# EAGLE design max522 (EAGLE 7.2.0)
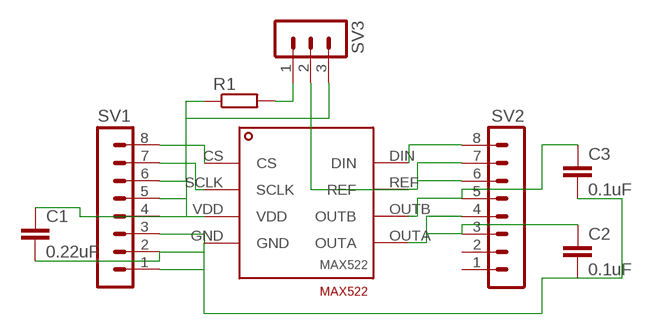
[diagram p0: schematic, sheet 1]

## Parts
C1  0.22uF  C-EUC0805  [C0805]
C2  0.1uF  C-EUC0805  [C0805]
C3  0.1uF  C-EUC0805  [C0805]
R1  R-EU_M0805  [M0805]
SV1  MA08-1  [MA08-1]
SV2  MA08-1  [MA08-1]
SV3  MA03-1  [MA03-1]
U$1  MAX522  [MAX522]

## Nets
N$1: SV1.8 U$1.CS
N$2: SV1.7 U$1.SCLK
N$3: C1.1 R1.1 SV1.4 SV1.5 SV1.6 SV3.3 U$1.VDD
N$4: C1.2 C2.2 C3.2 SV1.1 SV1.2 SV1.3 U$1.GND
N$5: SV2.8 U$1.DIN
N$6: SV2.6 SV2.7 SV3.2 U$1.REF
N$7: C3.1 SV2.5 U$1.OUTB
N$8: C2.1 SV2.3 SV2.4 U$1.OUTA
N$9: R1.2 SV3.1
Unconnected: SV2.1 SV2.2

## Library data of the parts
C1-C3 = rcl:C-EU: CAPACITOR, European symbol
R1 = resistor:R-EU_: RESISTOR, European symbol
SV1 SV2 = con-lstb:MA08-1: PIN HEADER; OC_FARNELL: unknown; OC_NEWARK: unknown
SV3 = con-lstb:MA03-1: PIN HEADER; OC_FARNELL: unknown; OC_NEWARK: unknown
U$1 = MAX522:MAX522

## Board
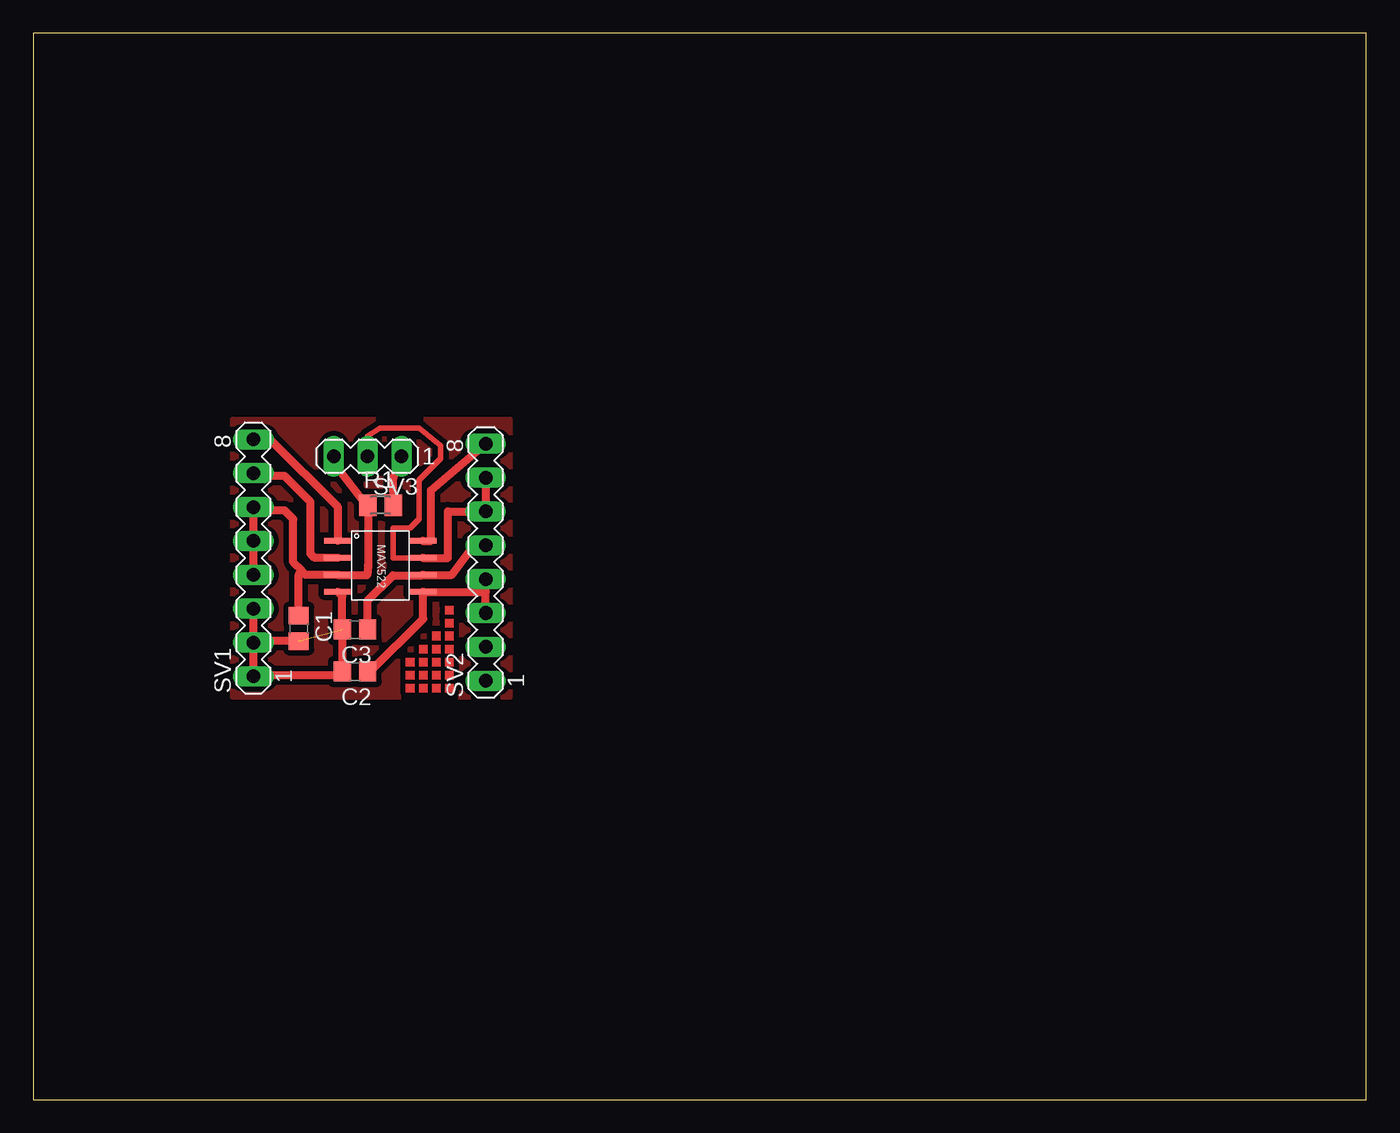
[diagram p1: board, top side]

Size 100 x 80 mm. Coordinates in mm from the lower left corner, seen from the top.
Outline: 0,0 100,0 100,80 0,80 0,0
Copper layers (1*16): Top 0.035mm / dielectric 1.5mm / Bottom 0.035mm
Design rules "default": minimum track width 10mil, minimum drill 24mil, track to track 8mil, track to pad 8mil, pad to pad 8mil, via to via 8mil, smd to smd 8mil, copper to edge 40mil, drill to drill 8mil, minimum pad ring 10mil, minimum via ring 8mil, stop-mask expansion 4mil, vias tented up to drill 0mil, thermal gap 10mil

### Footprints (pad centres in the part's own frame; a part is rotated, then mirrored left to right if it is on the bottom)
C0805 = smd 1.3 x 1.5: 1 -0.95,0; 2 0.95,0
M0805 = smd 1.3 x 1.6: 1 -0.95,0; 2 0.95,0
MA08-1 = drill 1.016 long: 1 -8.89,0; 2 -6.35,0; 3 -3.81,0; 4 -1.27,0; 5 1.27,0; 6 3.81,0; 7 6.35,0; 8 8.89,0
MA03-1 = drill 1.016 long: 1 -2.54,0; 2 0,0; 3 2.54,0
MAX522 = smd 2.1 x 0.406: CS -2.54,1.27; DIN 3.81,1.27; GND -2.54,-2.54; OUTA 3.81,-2.54; OUTB 3.81,-1.27; REF 3.81,0; SCLK -2.54,0; VDD -2.54,-1.27

### Placement (x,y rotation side)
C1  19.91,35.35 270 top
C2  24.13,32.1 180 top
C3  24.13,35.27 180 top
R1  26.05,44.59 0 top
SV1  16.51,40.64 90 top
SV2  33.94,40.31 90 top
SV3  25.07,48.26 180 top
U$1  25.4,40.64 0 top

### Tracks (layer width: path | path; a pad name or v marks a point on that pad's centre or on a via)
N$1
  Top 0.61: U$1.CS 22.86,44.45 17.78,49.53 SV1.8
N$2
  Top 0.61: U$1.SCLK 21.11,40.64 20.8,40.95 20.8,44.85 18.85,46.8 16.7,46.8 SV1.7
N$3
  Top 0.61: 20.15,39.65 20.43,39.37 U$1.VDD 22.91,39.33 25.02,39.33 25.1,40.05 R1.1 24.95,44.59 22.75,47.45 22.75,48.15 SV3.3 | 20.15,39.65 19.5,40.3 19.5,43.55 18.85,44.2 16.76,44.2 SV1.6 SV1.5 SV1.4 | C1.1 19.91,39.41 20.15,39.65
N$4  (1 unrouted)
  Top 0.61: C2.2 C3.2 23.18,37.78 U$1.GND | SV1.3 SV1.2 | SV1.2 SV1.1 | C1.2 16.62,34.4 SV1.2
N$5
  Top 0.61: U$1.DIN 29.83,41.91 29.83,45.72 34.29,49.53 SV2.8
N$6
  Top 0.406: SV3.2 25.07,49.77 26,50.38 28.93,50.38 30.55,49.08 30.55,48.1 28.93,46.48 28.93,43.55 28.27,42.9 26.98,42.9 26.98,40.62 29.2,40.62 U$1.REF
  Top 0.61: SV2.7 SV2.6 31.1,44.12 31.1,40.64 U$1.REF
N$7
  Top 0.61: SV2.5 33.02,41.59 31.39,39.37 U$1.OUTB 29.16,39.33 26.98,39.33 25.08,37.43 C3.1
N$8
  Top 0.61: 33.94,38.1 U$1.OUTA 29.25,38.06 29.25,36.08 25.28,32.1 C2.1 | 33.94,38.1 SV2.4 | SV2.3 33.94,38.1
N$9
  Top 0.61: SV3.1 26.96,46.51 R1.2
N$10
  Top 0.61: 16.57,31.85 23.4,31.85
N$11
  pour Top (isolate 0.406): 14.95,51.02 35.75,51.02 35.75,30.23 14.95,30.23
(copper drawn outside any net)
  shapes: Top area x20